# Altium project up_project.PrjPcb
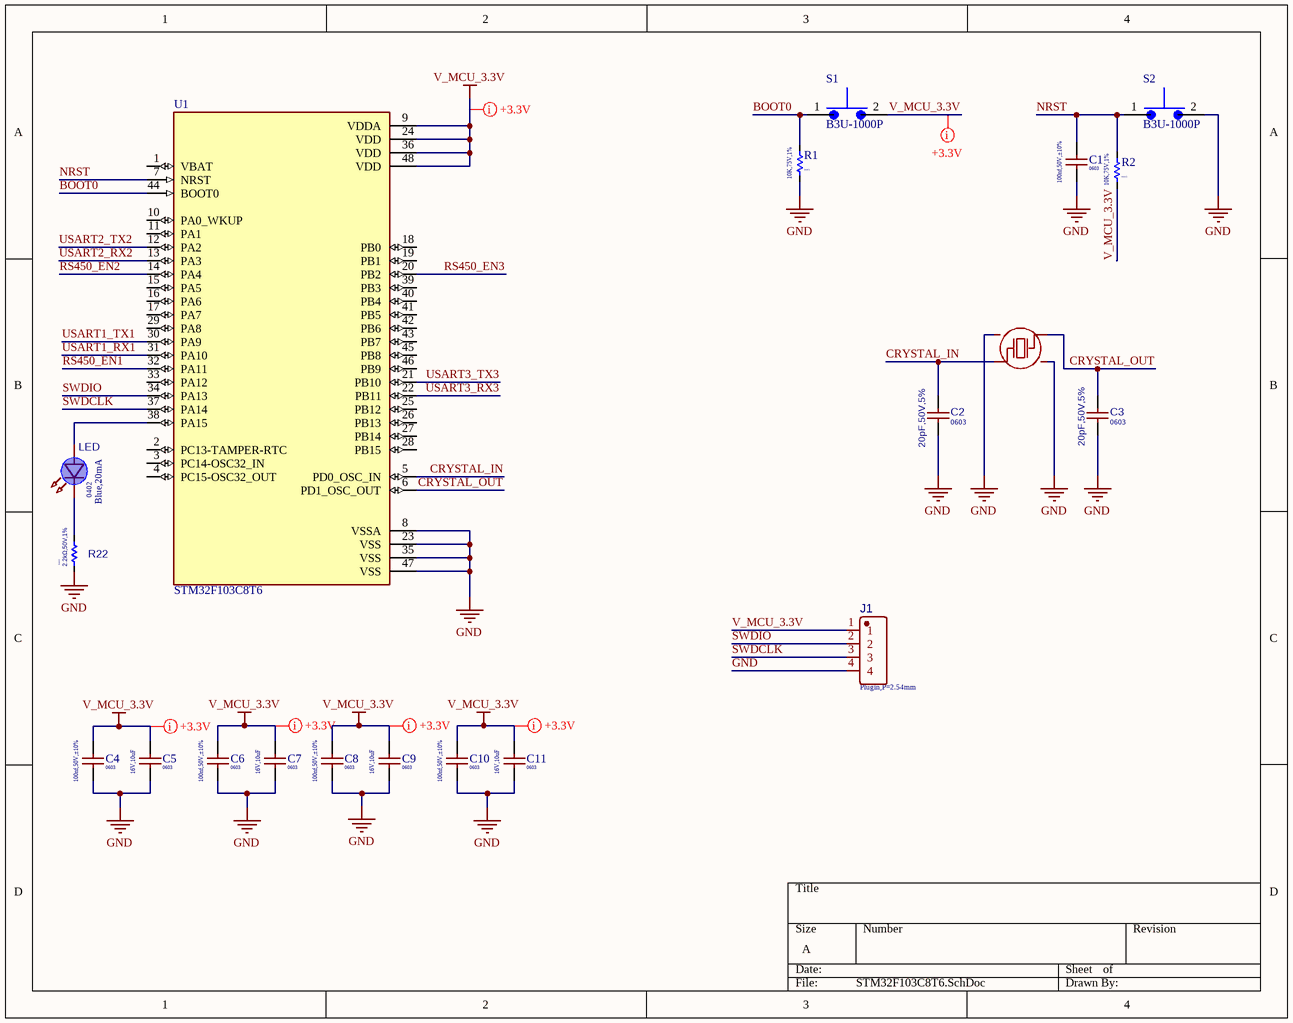
[diagram p0: STM32F103C8T6.SchDoc]
3 sheets, 59 parts. Net scope: global (net labels, ports and power ports of the same name join across sheets).
Board file: PCB1.PcbDoc
Sheets:
  STM32F103C8T6.SchDoc
  RS485.SchDoc
  12V to5v_5V to 3.3V.SchDoc

## Sheet STM32F103C8T6.SchDoc
size A; SheetNumber: 1; SheetTotal: 3

### Parts
C1  value 100nf,50V,±10%  Package: 0603  [C0603]  (hidden comment: CC0603KRX7R9BB104)
C2  value 20pF,50V,5%  Package: 0603  [C0603]  (hidden comment: 20pF)
C3  value 20pF,50V,5%  Package: 0603  [C0603]  (hidden comment: 20pF)
C4  value 100nf,50V,±10%  Package: 0603  [C0603]  (hidden comment: CC0603KRX7R9BB104)
C5  value 16V,10uF  Package: 0603  [CAPC1608X90N]  (hidden comment: 10uf)
C6  value 100nf,50V,±10%  Package: 0603  [C0603]  (hidden comment: CC0603KRX7R9BB104)
C7  value 16V,10uF  Package: 0603  [CAPC1608X90N]  (hidden comment: 10uf)
C8  value 100nf,50V,±10%  Package: 0603  [C0603]  (hidden comment: CC0603KRX7R9BB104)
C9  value 16V,10uF  Package: 0603  [CAPC1608X90N]  (hidden comment: 10uf)
C10  value 100nf,50V,±10%  Package: 0603  [C0603]  (hidden comment: CC0603KRX7R9BB104)
C11  value 16V,10uF  Package: 0603  [CAPC1608X90N]  (hidden comment: 10uf)
J1  Package: Plugin,P=2.54mm  [PIN_4,P=2.54mm]  (hidden comment: *)
LED  value Blue,20mA  Package: 0402  [LED 0402]  (hidden comment: XL-1005UBC)
R1  Package: 0603  [R0603]  (hidden comment: 10K,75V,1%)
R2  Package: 0603  [R0603]  (hidden comment: 10K,75V,1%)
R22  value 2.2kΩ,50V,1%  Package: 0402  [R0402]  (hidden comment: 2.2KΩ)
S1  B3U-1000P  [B3U-1000P]
S2  B3U-1000P  [B3U-1000P]
U1  STM32F103C8T6  [STM32F103C8T6]
X1  8MHz  [SMD3225-4P]  (value not drawn)

### Nets
GND: C1.1 C2.1 C3.1 C4.1 C5.1 C6.1 C7.1 C8.1 C9.1 C10.1 C11.1 J1.4 R1.2 R22.1 S2.2 U1.8(VSSA) U1.23(VSS) U1.35(VSS) U1.47(VSS) X1.2 X1.4
V_MCU_3.3V: C4.2 C5.2 C6.2 C7.2 C8.2 C9.2 C10.2 C11.2 J1.1 R2.2 S1.2 U1.9(VDDA) U1.24(VDD) U1.36(VDD) U1.48(VDD)
BOOT0: R1.1 S1.1 U1.44(BOOT0)
CRYSTAL_IN: C2.2 U1.5(PD0_OSC_IN) X1.1
CRYSTAL_OUT: C3.2 U1.6(PD1_OSC_OUT) X1.3
NRST: C1.2 R2.1 S2.1 U1.7(NRST)
RS450_EN1: U1.32(PA11)
RS450_EN2: U1.14(PA4)
RS450_EN3: U1.20(PB2)
SWDCLK: J1.3 U1.37(PA14)
SWDIO: J1.2 U1.34(PA13)
USART1_RX1: U1.31(PA10)
USART1_TX1: U1.30(PA9)
USART2_RX2: U1.13(PA3)
USART2_TX2: U1.12(PA2)
USART3_RX3: U1.22(PB11)
USART3_TX3: U1.21(PB10)
NetLED_1: LED.1(K) R22.2
NetLED_2: LED.2(A) U1.38(PA15)

Not connected (* = marked no-connect by the designer): U1 1(VBAT) 2(PC13-TAMPER-RTC) 3(PC14-OSC32_IN) 4(PC15-OSC32_OUT) 10(PA0_WKUP) 11(PA1) 15(PA5) 16(PA6) 17(PA7) 18(PB0) 19(PB1) 25(PB12) 26(PB13) 27(PB14) 28(PB15) 29(PA8) 33(PA12) 39(PB3) 40(PB4) 41(PB5) 42(PB6) 43(PB7) 45(PB8) 46(PB9)

### Layout directives
net class +3.3V: V_MCU_3.3V

### Library data of the parts
C1 C4 C6 C8 C10 = CC0603KRX7R9BB104: 50V 100nF X7R ±10% 0603 Multilayer Ceramic Capacitors MLCC - SMD/SMT ROHS; MPN: 603-CC603KRX7R9BB104; Manufacturer: KEMET; Max Operating Temp: 35 °C; Min Operating Temp: 15 °C; Datasheet: http://componentsearchengine.com/Datasheets/3/CC0603KRX7R9BB104.pdf; LCSC: C14663
C2 C3 = CL10C200JB8NNNC: 50V 20pF C0G ±5% 0603 Multilayer Ceramic Capacitors MLCC - SMD/SMT ROHS; Manufacturer: SHOU HAN; Type: *; MPN: CL10C200JB8NNNC; Max Operating Temp: +125; Min Operating Temp: -55; Datasheet: https://datasheet.lcsc.com/lcsc/2304140030_Samsung-Electro-Mechanics-CL10C200JB8NNNC_C1648.pdf; LCSC: C1648
C5 C7 C9 C11 = 0603F106M160NT: 16V 10uF Y5V ±20% 0603 Multilayer Ceramic Capacitors MLCC - SMD/SMT ROHS; Manufacturer: KEMET; MPN: CC0603KRX7R9BB104; Datasheet: http://componentsearchengine.com/Datasheets/3/CC0603KRX7R9BB104.pdf; LCSC: C48906
J1 = PZ254V-11-04P: Straight Square Pins 2.5mm 4P 6mm -40℃~+105℃ 3mm 2.54mm Plugin Black Brass 1x4P Plugin,P=2.54mm Pin Headers ROHS; Manufacturer: XFCN; Min temp: -40°C; Max temp: 105°C; Type: TH; Value: *; Datasheet: https://datasheet.lcsc.com/lcsc/2304140030_XFCN-PZ254V-11-04P_C492403.pdf; MPN: PZ254V-11-04P; LCSC: C2691448
LED = XL-1005UBC: 20mA 240mcd Colorless Transparent Lens -20℃~+85℃ 455nm~475nm Positive Stick Blue 120° 70mW 3.3V 0402 LED Indication - Discrete ROHS; Manufacturer: XINGLIGHT; Datasheet: https://www.lcsc.com/datasheet/lcsc_datasheet_2409271833_XINGLIGHT-XL-1005UBC_C22355736.pdf; LCSC: C22355736; MPN: XL-1005UBC
R1 R2 = 0603WAF1002T5E: 100mW Thick Film Resistors ±100ppm/℃ ±1% 10kΩ 0603 Chip Resistor - Surface Mount ROHS; Manufacturer: UNI-ROYAL(Uniroyal Elec); Max Operating Temp: 155℃; Min Operating Temp: -55℃; MPN: 0603WAF1002T5E; Datasheet: https://datasheet.lcsc.com/szlcsc/Uniroyal-Elec-0603WAF1002T5E_C25804.pdf; LCSC: C25804; Value: 10K,75V,1%
R22 = RC0402FR-072K2L: 62.5mW Thick Film Resistors 50V ±100ppm/℃ ±1% 2.2kΩ 0402 Chip Resistor - Surface Mount ROHS; Manufacturer: YAGEO; Max Operating Temp: +155; MPN: RC0402FR-072K2L; Datasheet: https://datasheet.lcsc.com/lcsc/2304140030_YAGEO-RC0402FR-072K2L_C114762.pdf; Min Operating Temp: -55; LCSC: C114762
S1 S2 = B3U-1000P: 2.5mm 1.6mm Round Button 50mA Brick nogging 3mm SPST 153gf 12V SMD,2.5x3mm Tactile Switches ROHS; Manufacturer: Omron Electronics; MPN: 653-B3U-1000P; Datasheet: https://www.omron.com/ecb/products/pdf/en-b3u.pdf; LCSC: C231329
U1 = STM32F103C8T6: Mainstream Performance line, ARM Cortex-M3 MCU with 64 Kbytes Flash, 72 MHz CPU, motor control, USB and CAN; Manufacturer: STMicroelectronics; Value: *; Package: LQFP-48(7x7); Datasheet: https://datasheet.lcsc.com/lcsc/2302211130_STMicroelectronics-STM32F103C8T6_C8734.pdf; LCSC: C8734
X1 = X32258MSB4SI: 8MHz Surface Mount Crystal 20pF ±10ppm ±20ppm SMD3225-4P Crystals ROHS; Manufacturer: YXC; LCSC: C2682774; MPN: X32258MSB4SI; Package: SMD3225-4P; Datasheet: https://www.lcsc.com/datasheet/lcsc_datasheet_2411121006_YXC-Crystal-Oscillators-X32258MSB4SI_C2682774.pdf; Operating Temperature: -40℃~+85℃

## Sheet RS485.SchDoc
size A; SheetNumber: 2; SheetTotal: 3
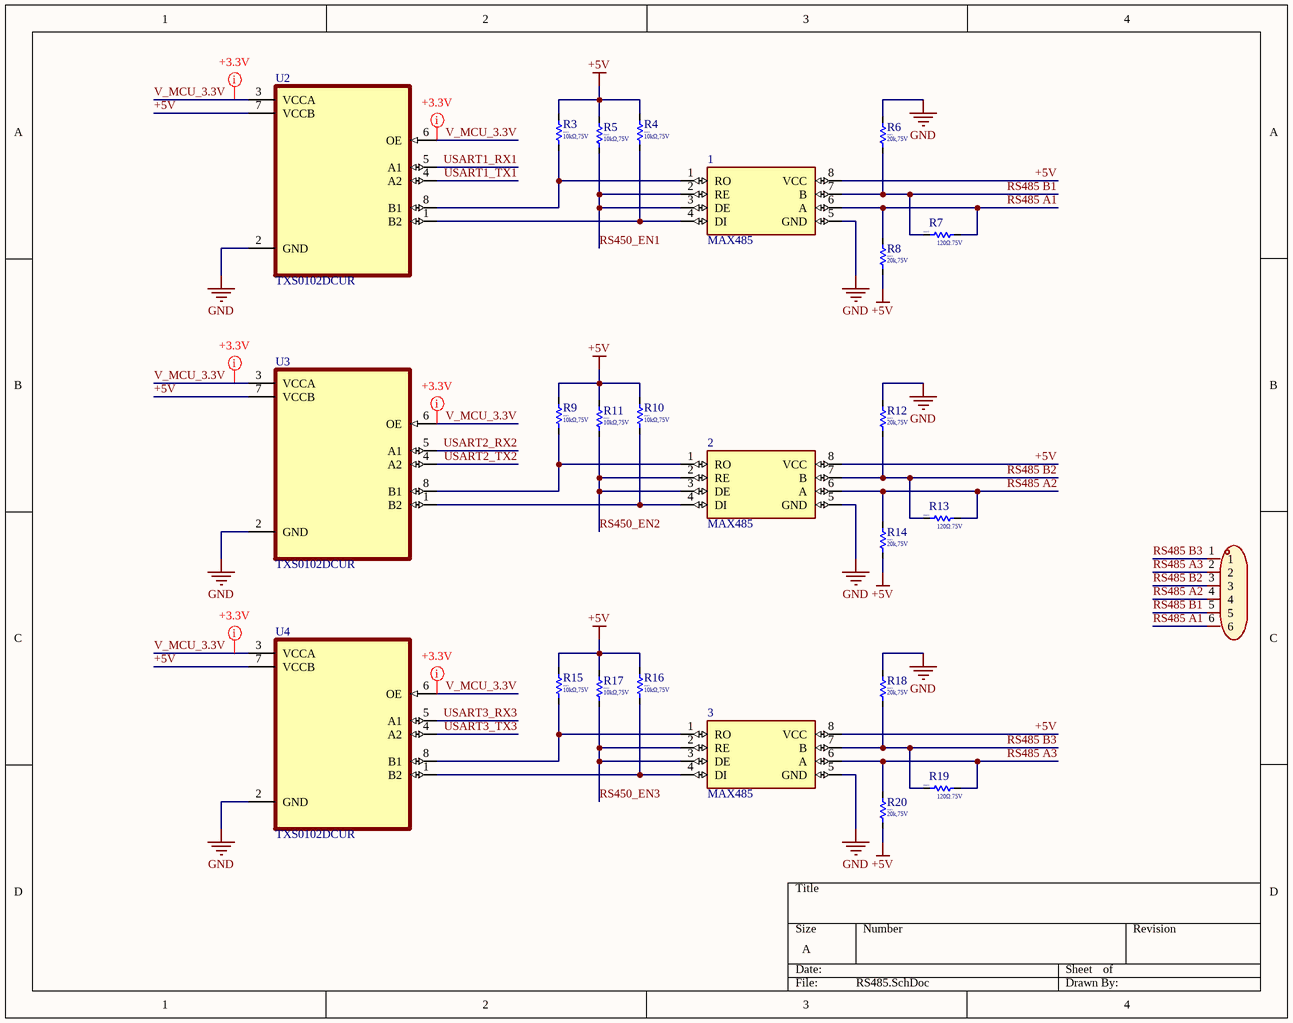
[diagram p1: RS485.SchDoc]

### Parts
1  MAX485  [MAX485]
2  MAX485  [MAX485]
3  MAX485  [MAX485]
CN1  DB128V-5.08-6P-GN-S  [6P_P=5.08mm]  (value not drawn)
R3  value 10kΩ,75V  Package: 0603  [R0603]  (hidden comment: 0603WAF100JT5E)
R4  value 10kΩ,75V  Package: 0603  [R0603]  (hidden comment: 0603WAF100JT5E)
R5  value 10kΩ,75V  Package: 0603  [R0603]  (hidden comment: 0603WAF100JT5E)
R6  value 20k,75V  Package: 0603  [R0603]  (hidden comment: 20k)
R7  value 120Ω.75V  Package: 0603  [R0603]  (hidden comment: 120R)
R8  value 20k,75V  Package: 0603  [R0603]  (hidden comment: 20k)
R9  value 10kΩ,75V  Package: 0603  [R0603]  (hidden comment: 0603WAF100JT5E)
R10  value 10kΩ,75V  Package: 0603  [R0603]  (hidden comment: 0603WAF100JT5E)
R11  value 10kΩ,75V  Package: 0603  [R0603]  (hidden comment: 0603WAF100JT5E)
R12  value 20k,75V  Package: 0603  [R0603]  (hidden comment: 20k)
R13  value 120Ω.75V  Package: 0603  [R0603]  (hidden comment: 120R)
R14  value 20k,75V  Package: 0603  [R0603]  (hidden comment: 20k)
R15  value 10kΩ,75V  Package: 0603  [R0603]  (hidden comment: 0603WAF100JT5E)
R16  value 10kΩ,75V  Package: 0603  [R0603]  (hidden comment: 0603WAF100JT5E)
R17  value 10kΩ,75V  Package: 0603  [R0603]  (hidden comment: 0603WAF100JT5E)
R18  value 20k,75V  Package: 0603  [R0603]  (hidden comment: 20k)
R19  value 120Ω.75V  Package: 0603  [R0603]  (hidden comment: 120R)
R20  value 20k,75V  Package: 0603  [R0603]  (hidden comment: 20k)
U2  TXS0102DCUR  [8-VSSOP]
U3  TXS0102DCUR  [8-VSSOP]
U4  TXS0102DCUR  [8-VSSOP]

### Nets
+5V: 1.8(VCC) 2.8(VCC) 3.8(VCC) R3.2 R4.2 R5.2 R8.1 R9.2 R10.2 R11.2 R14.1 R15.2 R16.2 R17.2 R20.1 U2.7(VCCB) U3.7(VCCB) U4.7(VCCB)
GND: 1.5(GND) 2.5(GND) 3.5(GND) R6.2 R12.2 R18.2 U2.2(GND) U3.2(GND) U4.2(GND)
V_MCU_3.3V: U2.3(VCCA) U2.6(OE) U3.3(VCCA) U3.6(OE) U4.3(VCCA) U4.6(OE)
RS450_EN1: 1.2(RE) 1.3(DE) R5.1
RS450_EN2: 2.2(RE) 2.3(DE) R11.1
RS450_EN3: 3.2(RE) 3.3(DE) R17.1
RS485 A1: 1.6(A) CN1.6 R7.2 R8.2
RS485 A2: 2.6(A) CN1.4 R13.2 R14.2
RS485 A3: 3.6(A) CN1.2 R19.2 R20.2
RS485 B1: 1.7(B) CN1.5 R6.1 R7.1
RS485 B2: 2.7(B) CN1.3 R12.1 R13.1
RS485 B3: 3.7(B) CN1.1 R18.1 R19.1
USART1_RX1: U2.5(A1)
USART1_TX1: U2.4(A2)
USART2_RX2: U3.5(A1)
USART2_TX2: U3.4(A2)
USART3_RX3: U4.5(A1)
USART3_TX3: U4.4(A2)
Net1_1: 1.1(RO) R3.1 U2.8(B1)
Net1_4: 1.4(DI) R4.1 U2.1(B2)
Net2_1: 2.1(RO) R9.1 U3.8(B1)
Net2_4: 2.4(DI) R10.1 U3.1(B2)
Net3_1: 3.1(RO) R15.1 U4.8(B1)
Net3_4: 3.4(DI) R16.1 U4.1(B2)

### Layout directives
net class +3.3V: V_MCU_3.3V

### Library data of the parts
1-3 = MAX485: 1/1 Transceiver Half RS422, RS485 8-SOIC; Manufacturer: Maxim Integrated; Package: SOIC-8 Maxim Integrated; Value: *; MPN: MAX485
CN1 = DB128V-5.08-6P-GN-S: 1x6P 20A -40℃~+105℃ 300V Green 12~30 Direct Insert 5.08mm 2.5 1 6 Plugin,P=5.08mm Screw Terminal; Manufacturer: DORABO; LCSC: C2915642; MPN: DB128V-5.08-6P-GN-S; Package: 插件,P=5.08mm; Datasheet: https://atta.szlcsc.com/upload/public/pdf/source/20230106/CC449C10514519CDCE20F1C37DBF2DAC.pdf; Operating Temperature Range: -40℃~+105℃
R3-R5 R9-R11 R15-R17 = 0603WAF100JT5E: 100mW Thick Film Resistors ±1% ±400ppm/℃ 10Ω 0603 Chip Resistor - Surface Mount ROHS; Manufacturer: UNI-ROYAL(Uniroyal Elec); MPN: 0603WAF1002T5E; Datasheet: https://datasheet.lcsc.com/szlcsc/Uniroyal-Elec-0603WAF1002T5E_C25804.pdf; LCSC: C25804
R6 R8 R12 R14 R18 R20 = 0603WAF2002T5E: 100mW Thick Film Resistors ±100ppm/℃ ±1% 20kΩ 0603 Chip Resistor - Surface Mount ROHS; Manufacturer: UNI-ROYAL(Uniroyal Elec); MPN: 0603WAF1002T5E; Datasheet: https://datasheet.lcsc.com/szlcsc/Uniroyal-Elec-0603WAF1002T5E_C25804.pdf; LCSC: C4184
R7 R13 R19 = 0603WAF1200T5E: 100mW Thick Film Resistors 75V ±100ppm/℃ ±1% 120Ω 0603 Chip Resistor - Surface Mount ROHS; Manufacturer: UNI-ROYAL(Uniroyal Elec); MPN: 0603WAF1002T5E; Datasheet: https://datasheet.lcsc.com/szlcsc/Uniroyal-Elec-0603WAF1002T5E_C25804.pdf; LCSC: C22787
U2-U4 = TXS0102DCUR: 2-Bit Bidirectional Voltage-Level Shifter for Open-Drain and Push-Pull Application 8-VSSOP -40 to 85; Manufacturer: Texas Instruments; Value: 2 Channel 24Mbps; MPN: TXS0102DCUR; Datasheet: https://www.ti.com/general/docs/suppproductinfo.tsp?distId=10&gotoUrl=https%3A%2F%2Fwww.ti.com%2Flit%2Fgpn%2Ftxs0102; LCSC: C53434; Package: VSSOP-8 Texas Instruments

## Sheet 12V to5v_5V to 3.3V.SchDoc
size A; SheetNumber: 3; SheetTotal: 3
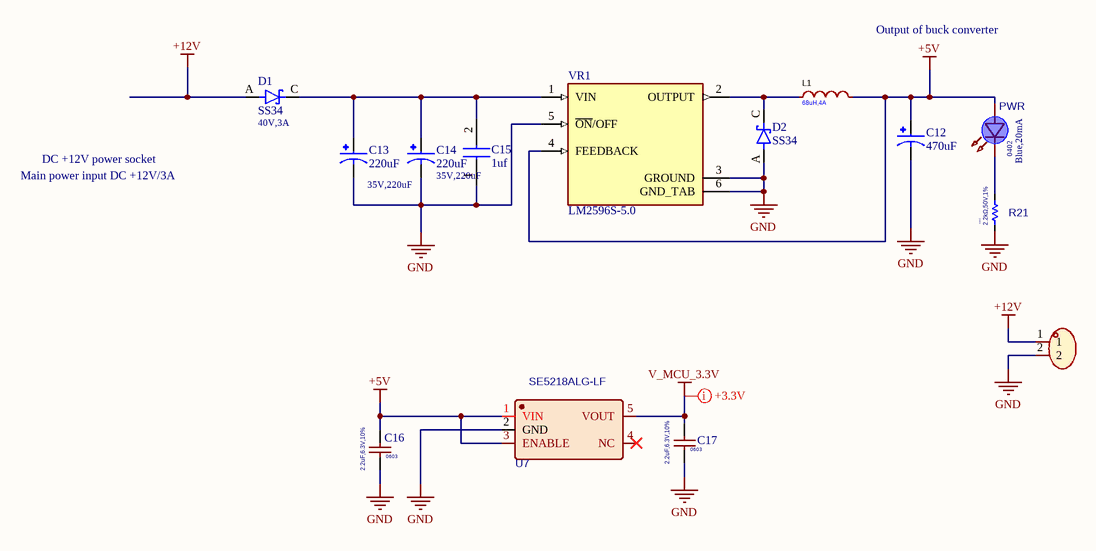
[diagram p2: 12V to5v_5V to 3.3V.SchDoc]

### Parts
C12  470uF  [Plugin,6.3x8mm]
C13  220uF  value 35V,220uF  [Plugin,6.3x8mm]
C14  220uF  value 35V,220uF  [Plugin,6.3x8mm]
C15  1uf  [C0805]
C16  Package: 0603  [C0603]  (hidden comment: 2.2uF,6.3V,10%)
C17  Package: 0603  [C0603]  (hidden comment: 2.2uF,6.3V,10%)
D1  SS34  value 40V,3A  [SMA]
D2  SS34  [SMA]
L1  value 68uH,4A  [ind_SMD_12.3x12.3mm]  (hidden comment: 68uH)
PWR  value Blue,20mA  Package: 0402  [LED 0402]  (hidden comment: XL-1005UBC)
R21  value 2.2kΩ,50V,1%  Package: 0402  [R0402]  (hidden comment: 2.2KΩ)
U5  DB128L-5.08-2P-GN-S  [2P_P=5.08mm]  (value not drawn)
U7  SE5218ALG-LF  [SOT-23-5]
VR1  LM2596S-5.0  [TO-263-5]

### Nets
+5V: C12.1 C16.1 L1.2 PWR.2(A) U7.1(VIN) U7.3(ENABLE) VR1.4(FEEDBACK)
+12V: D1.A U5.1
GND: C12.2 C13.2 C14.2 C15.1(C1) C16.2 C17.2 D2.A R21.1 U5.2 U7.2(GND) VR1.3(GROUND) VR1.5(~{ON}/OFF) VR1.6(GND_TAB)
V_MCU_3.3V: C17.1 U7.5(VOUT)
NetC13_1: C13.1 C14.1 C15.2(C2) D1.C(K) VR1.1(VIN)
NetD2_C: D2.C(K) L1.1 VR1.2(OUTPUT)
NetPWR_1: PWR.1(K) R21.2

Not connected (* = marked no-connect by the designer): U7 4(NC)*

### Layout directives
net class +3.3V: V_MCU_3.3V

### Notes on the sheet
- Output of buck converter
- Main power input DC +12V/3A
- DC +12V power socket

### Library data of the parts
C12 = SPTOJM471E08OR: 6.3V 470uF ±20% Plugin,6.3x8mm Solid Capacitors ROHS; MPN: EEE-HC1H101P; Manufacturer: Panasonic; Package Reference: RADIAL-2 Panasonic; Value: *
C13 C14 = NPXC1101V221MJTM: 220uF 35V ±20% Plugin,D6.3xL11mm Aluminum Electrolytic Capacitors - Leaded ROHS; Manufacturer: Ymin; Package: Plugin,D6.3xL11mm; MPN: NPXC1101V221MJTM; Datasheet: https://www.lcsc.com/datasheet/lcsc_datasheet_2205250916_Ymin-NPXC1101V221MJTM_C2976311.pdf; LCSC: C2976311
C15 = CL21B105KBFNNNE: 50V 1uF X7R ±10% 0805 Multilayer Ceramic Capacitors MLCC - SMD/SMT ROHS; Manufacturer: KEMET; MPN: CC0603JRNPO9BN180
C16 C17 = CGA3E1X7R0J225K080AC: CAP CER 2.2UF 6.3V X7R 0603; Manufacturer: TDK Corporation; Type: SM; Min Operating Temp: -55°C; Max Operating Temp: 125°C; MPN: CGA3E1X7R0J225K080AC; Datasheet: https://product.tdk.com/system/files/dam/doc/product/capacitor/ceramic/mlcc/catalog/mlcc_automotive_general_en.pdf; Value: 2.2uF,6.3V,10%
D1 D2 = SS34: Diode Schottky 40V 3A 2-Pin SMC T/R; MPN: SS34
  D1: Package: None
  D2: Value: *; Package Reference: None
L1 = SMDRI127-680MT: 2.1A 68uH Shielded inductor ±20% 4A SMD,12.3x12.3mm Power Inductors ROHS; Manufacturer: SXN(顺翔诺); LCSC: C9907; MPN: SMDRI127-680MT; Package: SMD,12.3x12.3mm; Datasheet: https://atta.szlcsc.com/upload/public/pdf/source/20210810/6F96FDC19AA308DD2AD166FFB9640E87.pdf
PWR = XL-1005UBC: as LED on sheet STM32F103C8T6; Datasheet: https://www.lcsc.com/datasheet/lcsc_datasheet_2409271833_XINGLIGHT-XL-1005UBC_C22355736.pdf; LCSC: C22355736; MPN: XL-1005UBC
R21 = RC0402FR-072K2L: as R22 on sheet STM32F103C8T6; Max Operating Temp: +155; MPN: RC0402FR-072K2L; Datasheet: https://datasheet.lcsc.com/lcsc/2304140030_YAGEO-RC0402FR-072K2L_C114762.pdf; Min Operating Temp: -55; LCSC: C114762
U5 = DB128L-5.08-2P-GN-S: 1x2P 18A -40℃~+105℃ 250V Green 12~30 Direct Insert 5.08mm 2.5 1 2 Plugin,P=5.08mm Screw Terminal; Manufacturer: DORABO; Lcsc: C395868; MPN: DB128L-5.08-2P-GN-S; Package: 插件,P=5.08mm; Datasheet: https://atta.szlcsc.com/upload/public/pdf/source/20230106/B067FE0E641A396A370D47F93C345689.pdf; Operating Temperature Range: -40℃~+105℃
U7 = SE5218ALG-LF: 75dB 500mA Adjustable 3.3V Positive electrode 5V SOT-23-5 Voltage Regulators - Linear, Low Drop Out (LDO) Regulators ROHS; Manufacturer: SEAWARD(思旺); MPN: SE5218ALG-LF; LCSC: C118233; Datasheet: https://www.lcsc.com/datasheet/lcsc_datasheet_2304140030_Seaward-Elec-SE5218ALG-LF_C118233.pdf; Package: SOT-23-5
VR1 = LM2596S-5.0: Step-down type Fixed 40V~40V 5V 3A TO-263-5 DC-DC Converters ROHS; Value: *; Package Reference: None; MPN: LM2596S-5.0

## Nets that join several sheets
+5V: RS485 (18 pins), 12V to5v_5V to 3.3V (7 pins)
GND: STM32F103C8T6 (21 pins), RS485 (9 pins), 12V to5v_5V to 3.3V (13 pins)
V_MCU_3.3V: STM32F103C8T6 (15 pins), RS485 (6 pins), 12V to5v_5V to 3.3V (C17.1 U7.5)
RS450_EN1: STM32F103C8T6 (U1.32), RS485 (1.2 1.3 R5.1)
RS450_EN2: STM32F103C8T6 (U1.14), RS485 (2.2 2.3 R11.1)
RS450_EN3: STM32F103C8T6 (U1.20), RS485 (3.2 3.3 R17.1)
USART1_RX1: STM32F103C8T6 (U1.31), RS485 (U2.5)
USART1_TX1: STM32F103C8T6 (U1.30), RS485 (U2.4)
USART2_RX2: STM32F103C8T6 (U1.13), RS485 (U3.5)
USART2_TX2: STM32F103C8T6 (U1.12), RS485 (U3.4)
USART3_RX3: STM32F103C8T6 (U1.22), RS485 (U4.5)
USART3_TX3: STM32F103C8T6 (U1.21), RS485 (U4.4)